# Altium schematic sheet Parte_digital.SchDoc
size A
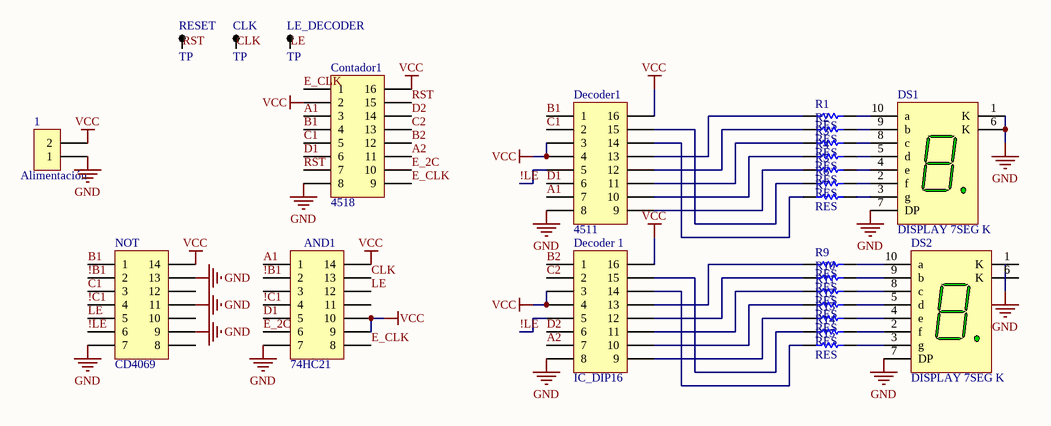
[diagram p0: Parte_digital.SchDoc]

## Parts
1  Alimentación  [BORNERA2]
AND1  74HC21  [DIP14]
CLK  TP  [TPTH]
Contador1  4518  [DIP16]
Decoder1  4511  [DIP16]
Decoder_1  IC_DIP16  [DIP16]
DS1  DISPLAY 7SEG K  [DISPLAY_LED_0.3"]
DS2  DISPLAY 7SEG K  [DISPLAY_LED_0.3"]
LE_DECODER  TP  [TPTH]
NOT  CD4069  [DIP14]
R1  RES  [RES400]
R2  RES  [RES400]
R3  RES  [RES400]
R4  RES  [RES400]
R5  RES  [RES400]
R6  RES  [RES400]
R7  RES  [RES400]
R9  RES  [RES400]
R10  RES  [RES400]
R11  RES  [RES400]
R12  RES  [RES400]
R13  RES  [RES400]
R14  RES  [RES400]
R15  RES  [RES400]
RESET  TP  [TPTH]

## Nets
GND: 1.1 AND1.7 Contador1.8 Decoder1.8 Decoder_1.8 DS1.1(K) DS1.6(K) DS1.7(DP) DS2.7(DP) NOT.7 NOT.9 NOT.11 NOT.13
VCC: 1.2 AND1.9 AND1.10 AND1.14 Contador1.2 Contador1.16 Decoder1.3 Decoder1.4 Decoder1.16 Decoder_1.3 Decoder_1.4 Decoder_1.16 NOT.14
!B1: AND1.2 NOT.2
!C1: AND1.4 NOT.4
!LE: Decoder1.5 Decoder_1.5 NOT.6
A1: AND1.1 Contador1.3 Decoder1.7
A2: Contador1.11 Decoder_1.7
B1: Contador1.4 Decoder1.1 NOT.1
B2: Contador1.12 Decoder_1.1
C1: Contador1.5 Decoder1.2 NOT.3
C2: Contador1.13 Decoder_1.2
CLK: AND1.13 CLK.1
D1: AND1.5 Contador1.6 Decoder1.6
D2: Contador1.14 Decoder_1.6
E_2C: AND1.6 Contador1.10
E_CLK: AND1.8 Contador1.1 Contador1.9
LE: AND1.12 LE_DECODER.1 NOT.5
RST: Contador1.7 Contador1.15 RESET.1
NetDecoder1_9: Decoder1.9 R5.1
NetDecoder1_10: Decoder1.10 R4.1
NetDecoder1_11: Decoder1.11 R3.1
NetDecoder1_12: Decoder1.12 R2.1
NetDecoder1_13: Decoder1.13 R1.1
NetDecoder1_14: Decoder1.14 R7.1
NetDecoder1_15: Decoder1.15 R6.1
NetDecoder_1_9: Decoder_1.9 R13.1
NetDecoder_1_10: Decoder_1.10 R12.1
NetDecoder_1_11: Decoder_1.11 R11.1
NetDecoder_1_12: Decoder_1.12 R10.1
NetDecoder_1_13: Decoder_1.13 R9.1
NetDecoder_1_14: Decoder_1.14 R15.1
NetDecoder_1_15: Decoder_1.15 R14.1
NetDS1_2: DS1.2(f) R6.2
NetDS1_3: DS1.3(g) R7.2
NetDS1_4: DS1.4(e) R5.2
NetDS1_5: DS1.5(d) R4.2
NetDS1_8: DS1.8(c) R3.2
NetDS1_9: DS1.9(b) R2.2
NetDS1_10: DS1.10(a) R1.2
NetDS2_2: DS2.2(f) R14.2
NetDS2_3: DS2.3(g) R15.2
NetDS2_4: DS2.4(e) R13.2
NetDS2_5: DS2.5(d) R12.2
NetDS2_8: DS2.8(c) R11.2
NetDS2_9: DS2.9(b) R10.2
NetDS2_10: DS2.10(a) R9.2

Not connected (* = marked no-connect by the designer): AND1 3 11; DS2 1(K) 6(K); NOT 8 10 12

## Library data of the parts
1 = BORNERA 2
AND1 NOT = IC_DIP14
Contador1 Decoder1 = IC_DIP16
DS1 DS2 = DISPLAY 7SEG K: Display 7 Segmentos Catodo Común